# Altium project STM32_BUCK_PCB_Project.PrjPcb
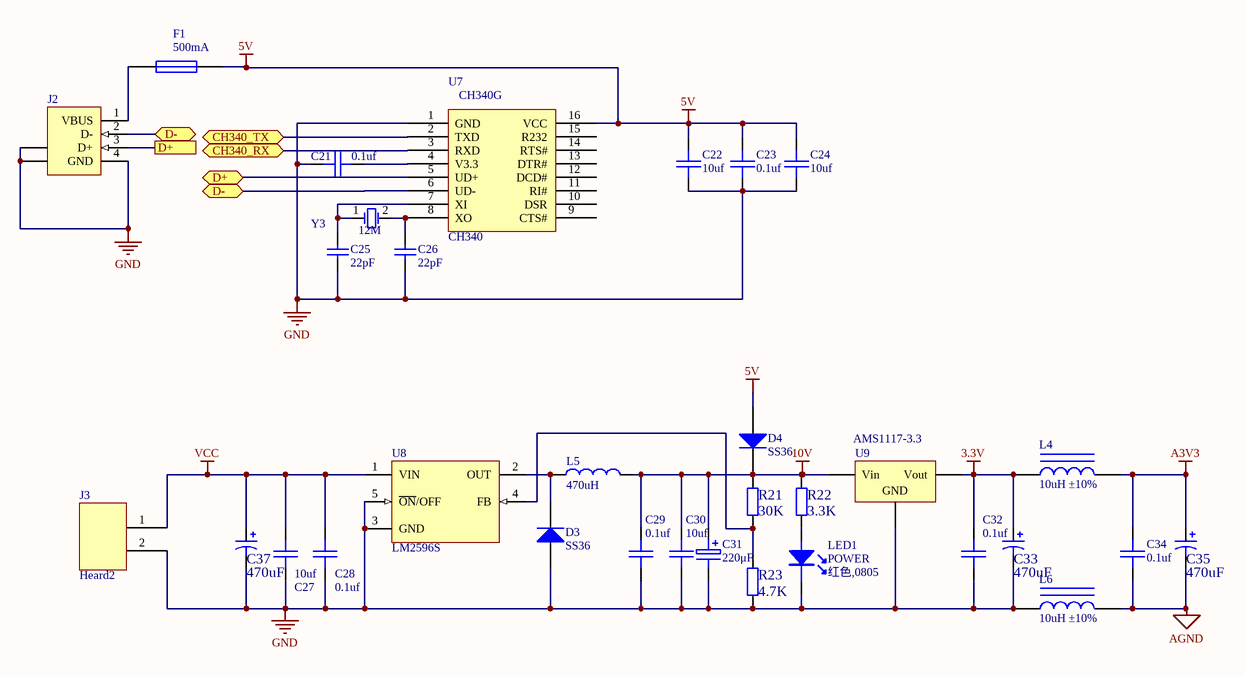
[diagram p0: 辅助电源.SchDoc]
1 sheet, 32 parts. Net scope: flat (ports and power ports of the same name join across sheets).
Board file: stm32_buck_PCB1.PcbDoc

## Sheet 辅助电源.SchDoc
size A3

### Parts
C21  0.1uf  [0805]
C22  10uf  [0805]
C23  0.1uf  [0805]
C24  10uf  [0805]
C25  22pF  [0805R]
C26  22pF  [0805R]
C27  10uf  [0805]
C28  0.1uf  [0805]
C29  0.1uf  [0805]
C30  10uf  [0805]
C31  220μF  [RB-220T]
C32  0.1uf  [0805]
C33  value 470uF  [RB-220T]  (hidden comment: Cap Pol1)
C34  0.1uf  [0805]
C35  value 470uF  [RB-220T]  (hidden comment: Cap Pol1)
C37  value 470uF  [RB-220T]  (hidden comment: Cap Pol1)
D3  SS36  [SMC(DO-214AB)_S1]
D4  SS36  [SMC(DO-214AB)_S1]
F1  500mA  [1812]
J2  1-1470156-2  [1-1470156]  (value not drawn)
J3  Heard2  [8.5端子]
L4  10uH ±10%  [0805_L]
L5  value 470uH  [L-12X12S]  (hidden comment: INDUCTOR1)
L6  10uH ±10%  [0805_L]
LED1  POWER  value 红色,0805  [LED-0805]
R21  30K  [0805R]
R22  3.3K  [0805R]
R23  4.7K  [0805R]
U7  CH340  [SOIC-16]
U8  LM2596S  [TO-263-5]
U9  AMS1117-3.3  [SOT-223]
Y3  12M  [晶振]

### Ports
CH340_RX (bidir), CH340_TX (bidir), D+, D+ (bidir), D- (bidir)

### Nets
3.3V: C32.2 C33.1 L4.1 U9.2(Vout)
5V: C22.2 C23.2 C24.2 D4.1(A) F1.2 U7.16(VCC)
10V: C29.2 C30.2 C31.1 D4.2(K) L5.2 R21.2 R22.2 U9.3(Vin)
A3V3: C34.2 C35.1 L4.2
AGND: C34.1 C35.2 L6.2
GND: C21.2 C22.1 C23.1 C24.1 C25.1 C26.1 C27.1 C28.1 C29.1 C30.1 C31.2 C32.1 C33.2 C37.2 D3.1(A) J2.4(GND) J2.5(SHLD) J2.6(SHLD) J3.2 L6.1 LED1.2 R23.1 U7.1(GND) U8.3(GND) U8.5(~{ON}/OFF) U9.1(GND)
VCC: C27.2 C28.2 C37.1 J3.1 U8.1(VIN)
NetC21_1: C21.1 U7.4(V3.3)
NetC25_2: C25.2 U7.7(XI) Y3.1(OSC1)
NetC26_2: C26.2 U7.8(XO) Y3.2(OSC2)
NetD3_2: D3.2(K) L5.1 U8.2(OUT)
NetF1_1: F1.1 J2.1(VBUS)
NetJ2_2: J2.2(D-) U7.6(UD-) ; port D-
NetJ2_3: J2.3(D+) U7.5(UD+) ; port D+
NetLED1_1: LED1.1 R22.1
NetR21_1: R21.1 R23.2 U8.4(FB)
NetU7_2: U7.2(TXD) ; port CH340_TX
NetU7_3: U7.3(RXD) ; port CH340_RX

Not connected (* = marked no-connect by the designer): U7 9(CTS#) 10(DSR) 11(RI#) 12(DCD#) 13(DTR#) 14(RTS#) 15(R232)

### Notes on the sheet
- (in symbol CH340) CH340G

### Library data of the parts
C21-C24 C27-C30 C32 C34 = CAP1_1: Capacitor; 物料代码: 1.02.01.0032; 名称: 电容; 规格型号: 104,±10%,50V,X7R,0603,*,RoHS; 封装: 0603; 设备封装名称: C0603_104_X7R_50V_10%; 贴片和直插: SMT; 现有库存: 1572305; RoHS: RoHS; ComponentLink1Description: ErpDataInfo; ComponentLink1URL: http://192.168.0.2:8012/ErpExt/ErpData/ListMateriel.aspx?pkey=1.02.01.0032
  C21 C23 C28 C29 C32 C34: Value: 0.1uf
  C22 C24 C27 C30: Value: 10uf
C25 C26 = Cap: Capacitor; Published: 8-Jun-2000; LatestRevisionDate: 17-Jul-2002; LatestRevisionNote: Re-released for DXP Platform.; PackageReference: RAD-0.3; Publisher: Altium Limited; PackageDescription: Radial Cap, Thru-Hole; 2 Leads; 0.3 in Pin Spacing; Value: 22pF
C31 = CAP ELECTRO1: Electrolytic Capacitor; 物料代码: 1.02.06.0002; 名称: V型铝电解电容; 规格型号: 220μF,16V,Ф6.3×7.7mm,,珠海华冠,RoHS; 厂商: 珠海华冠; 贴片和直插: SMT; 现有库存: 4627; Value: 220μF; RoHS: RoHS; ComponentLink1Description: ErpDataInfo; ComponentLink1URL: http://192.168.0.2:8012/ErpExt/ErpData/ListMateriel.aspx?pkey=1.02.06.0002
C33 C35 C37 = Cap Pol1: Polarized Capacitor (Radial); Published: 8-Jun-2000; LatestRevisionDate: 17-Jul-2002; LatestRevisionNote: Re-released for DXP Platform.; PackageReference: RB7.6-15; Publisher: Altium Limited; PackageDescription: Polarized Capacitor (Radial); 2 Leads
D3 D4 = SMC(DO-214AB) SS36-E3/57T: 二极管; ComponentLink1Description: 供应商链接; ComponentLink1URL: http://www.szlcsc.com/product/details_36698.html; Package: SMC(DO-214AB); Supplier: LC; SuppliersPartNumber: C35722
F1 = Fuse 1: Fuse; Published: 8-Jun-2000; LatestRevisionDate: 17-Jul-2002; LatestRevisionNote: Re-released for DXP Platform.; PackageReference: PIN-W2/E2.8; Publisher: Altium Limited; PackageDescription: Thru-Hole; 2 Leads
J2 = 1-1470156-2: USB 1.1, Right Angle, Thru-Hole, B Type, Receptacle, 4 Position, Black; ContactMaterial: Phosphor Bronze; ContactPlating: Gold over Nickel; TerminationLength: 3.00mm [0.118in.]; PCB_Layout: Complies with manufacturer's recommendation.; DrillSize: Corresponds to nominal value.; PanelGround: Without; Published: 15-Jul-2004; DatasheetDocument: 02-Jun-2001; PackageDocument: 02-Jun-2001; PackageReference: 1-1470156; Publisher: Altium Limited; HousingMaterial: Glass-Filled Thermoplastic; ComponentLink1Description: Manufacturer Link; ComponentLink1URL: http://www.tycoelectronics.com/; ComponentLink2Description: Packaging Specification; ComponentLink2URL: http://ecommas.tycoelectronics.com/commerce/DocumentDelivery/DDEController?Action=showdoc&DocId=Customer+Drawing%7F1470156%7FO%7Ftif%7FEnglish%7FC_1470156_O.tif
J3 = Header2
L4 L6 = 0805 10uH 10%: 贴片电感; ComponentLink1Description: 供应商链接; ComponentLink1URL: http://www.szlcsc.com/product/details_1398.html; Package: 0805; Supplier: LC; SuppliersPartNumber: C1046
L5 = INDUCTOR1: 物料代码: 1.03.01.0049; 名称: 电感; 规格型号: SPRH125-330M; 贴片和直插: SMT; 现有库存: 80; ComponentLink1Description: ErpDataInfo; ComponentLink1URL: http://192.168.0.2:8012/ErpExt/ErpData/ListMateriel.aspx?pkey=1.03.01.0049
LED1 = LED1: 物料代码: 1.04.05.0001; 名称: 发光二极管; 规格型号: 红色,0805,0805,RoHS; 封装: 0805; 设备封装名称: LED0805-RED; 贴片和直插: SMT; 器件优选方案: 优先选用; 现有库存: 41928; RoHS: RoHS; ComponentLink1Description: ErpDataInfo; ComponentLink1URL: http://192.168.0.2:8012/ErpExt/ErpData/ListMateriel.aspx?pkey=1.04.05.0001
R21-R23 = Res2: Resistor; Published: 8-Jun-2000; LatestRevisionDate: 17-Jul-2002; LatestRevisionNote: Re-released for DXP Platform.; PackageReference: AXIAL-0.4; Publisher: Altium Limited; PackageDescription: Axial Device, Thru-Hole; 2 Leads; 0.4 in Pin Spacing
  R21: Value: 30K
  R22: Value: 3.3K
  R23: Value: 4.7K
U7 = CH340: USB转串口
U8 = LM2596SX-5.0/NOPB_[C10002]: DC-DC芯片; ComponentLink1Description: 供应商链接; ComponentLink1URL: http://www.szlcsc.com/product/details_10538.html; Package: TO-263-5; Supplier: LC; SuppliersPartNumber: C10002
U9 = SOT-223 AMS1117-3.3: 低压差线性稳压(LDO); ComponentLink1Description: 供应商链接; ComponentLink1URL: http://www.szlcsc.com/product/details_6652.html; Package: SOT-223; Supplier: LC; SuppliersPartNumber: C6186
Y3 = 晶振